# Altium schematic sheet ASIC-Board.SchDoc: Frontend - Top Level
size A4; Date: 23.09.2023; ApprovedBy: M.Sc. Tobias Wirth; CheckedBy: M.Sc. Tobias Wirth; Author: M.Sc. Tobias Wirth; CompanyName: University of Stuttgart; DrawnBy: M.Sc. Tobias Wirth; Engineer: M.Sc. Tobias Wirth; Organization: IIS; Address1: Pfaffenwaldring 47; Address2: 70569 Stuttgart; Revision: V1.1; SheetNumber: 1; SheetTotal: 3; ProjectNameAlt: AUS - NMR System; Time: 18:00; ImagePath: N/A; Application_BuildNumber: N/A
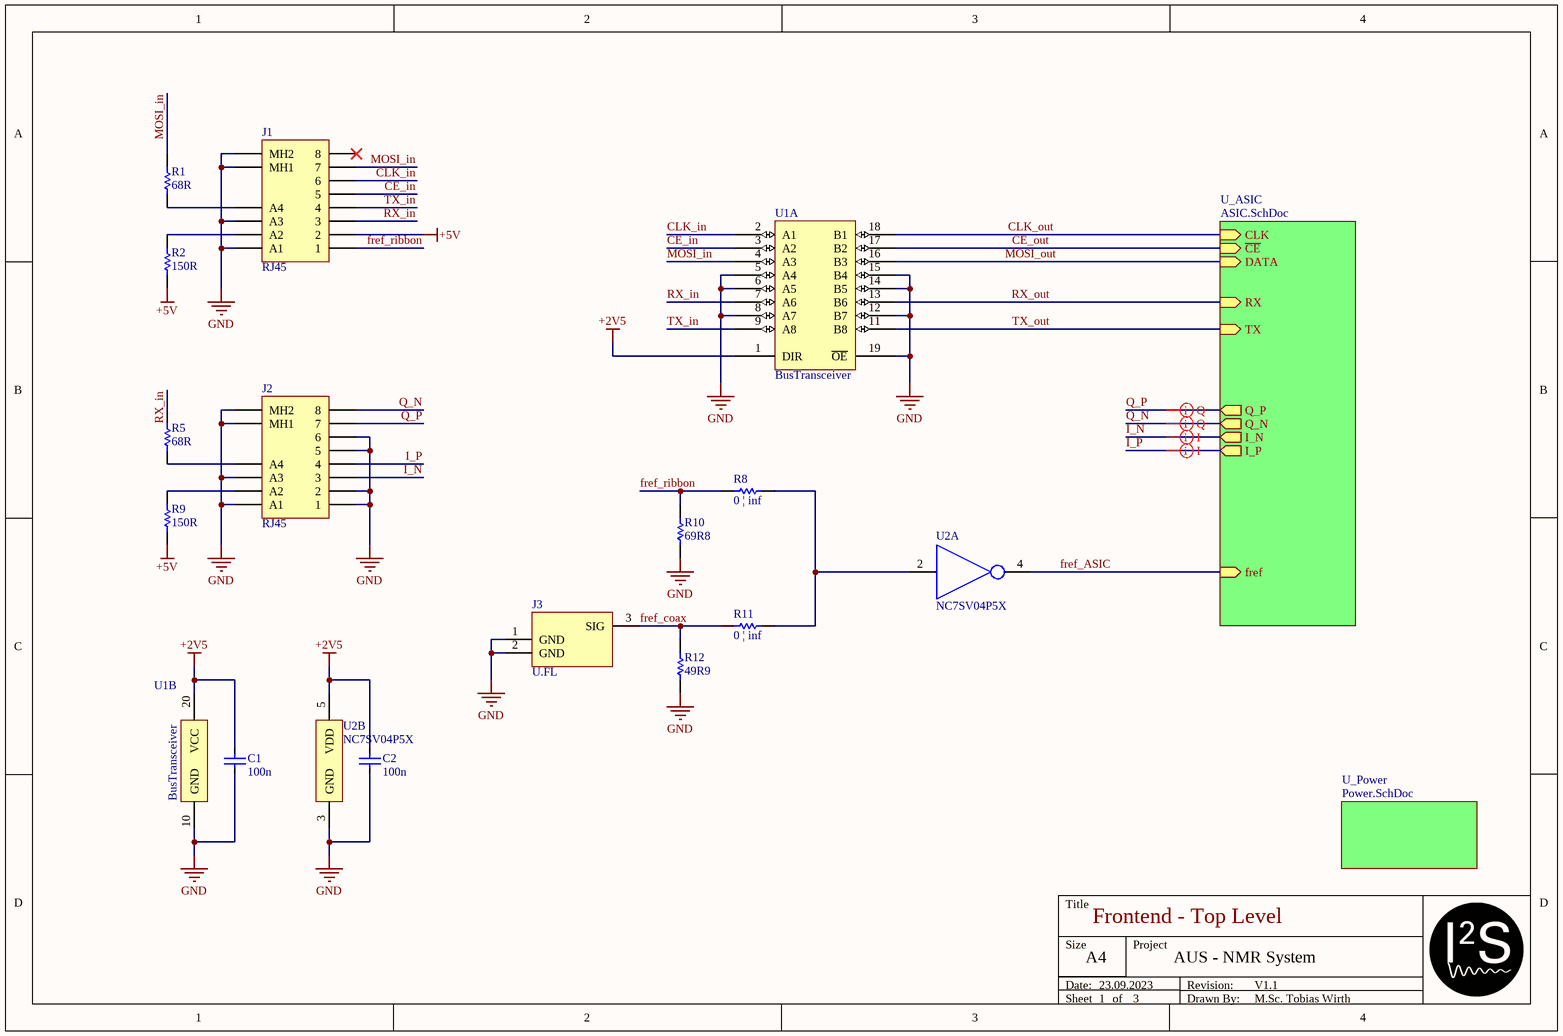
[diagram p0: ASIC-Board.SchDoc]

## Parts
C1  100n  [CAP_0402]
C2  100n  [CAP_0402]
J1  RJ45  [RJ45 - RJE3A1880412]
J2  RJ45  [RJ45 - RJE3A1880412]
J3  U.FL  [U.FL]
R1  68R  [RES_0603]
R2  150R  [RES_0603]
R5  68R  [RES_0603]
R8  0 | inf  [RES_0402]
R9  150R  [RES_0603]
R10  69R8  [RES_0402]
R11  0 | inf  [RES_0402]
R12  49R9  [RES_0402]
U1  BusTransceiver  [TSSOP-20]  (parts A,B of 2)
U2  NC7SV04P5X  [SOT23-65P210X110-5N]  (parts A,B of 2)

## Sub-sheets
U_ASIC = ASIC.SchDoc: Q_N (out), Q_P (out), I_P (out), I_N (out), CLK (in), ~{CE} (in), DATA (in), fref (in), TX (in), RX (in)
U_Power = Power.SchDoc: no entries

## Nets
+2V5: C1.1 C2.1 U1.1(DIR) U1.20(VCC) U2.5(VDD)
+5V: J1.2 R2.2 R9.2
GND: C1.2 C2.2 J1.A1 J1.A3 J1.MH1 J1.MH2 J2.1 J2.2 J2.5 J2.6 J2.A1 J2.A3 J2.MH1 J2.MH2 J3.1(GND) J3.2(GND) R10.1 R12.1 U1.5(A4) U1.6(A5) U1.8(A7) U1.10(GND) U1.12(B7) U1.14(B5) U1.15(B4) U1.19(~{OE}) U2.3(GND)
CE_in: J1.5 U1.3(A2)
CE_out: U1.17(B2) ; sheet U_ASIC/~{CE}
CLK_in: J1.6 U1.2(A1)
CLK_out: U1.18(B1) ; sheet U_ASIC/CLK
fref_ASIC: U2.4 ; sheet U_ASIC/fref
fref_coax: J3.3(SIG) R11.2 R12.2
fref_ribbon: J1.1 R8.2 R10.2
I_N: J2.3 ; sheet U_ASIC/I_N
I_P: J2.4 ; sheet U_ASIC/I_P
MOSI_in: J1.7 R1.1 U1.4(A3)
MOSI_out: U1.16(B3) ; sheet U_ASIC/DATA
Q_N: J2.8 ; sheet U_ASIC/Q_N
Q_P: J2.7 ; sheet U_ASIC/Q_P
RX_in: J1.3 R5.1 U1.7(A6)
RX_out: U1.13(B6) ; sheet U_ASIC/RX
TX_in: J1.4 U1.9(A8)
TX_out: U1.11(B8) ; sheet U_ASIC/TX
NetJ1_A2: J1.A2 R2.1
NetJ1_A4: J1.A4 R1.2
NetJ2_A2: J2.A2 R9.1
NetJ2_A4: J2.A4 R5.2
NetR8_1: R8.1 R11.1 U2.2

Not connected (* = marked no-connect by the designer): J1 8*

## Layout directives
differential pair; differential pair class IQ; net class Diffnets: I_N, I_P, Q_N, Q_P

## Notes on the sheet
- Title
- Size
- Date:
- Sheet
- A4
- of
- Project
- Drawn By:
- Revision:

## Library data of the parts
C1 C2 = Cap: Supplier: *; Part Number: *; Value: 100n
J1 J2 = RJ45: Ethernet Connectors RJ45 SMT
R1 R2 R5 R8-R12 = Res: Part Number: *; Supplier: *
  R1 R5: Value: 68R
  R2 R9: Value: 150R
  R8 R11: Value: 0 | inf
  R10: Value: 69R8
  R12: Value: 49R9
U1 = 74LVC245A